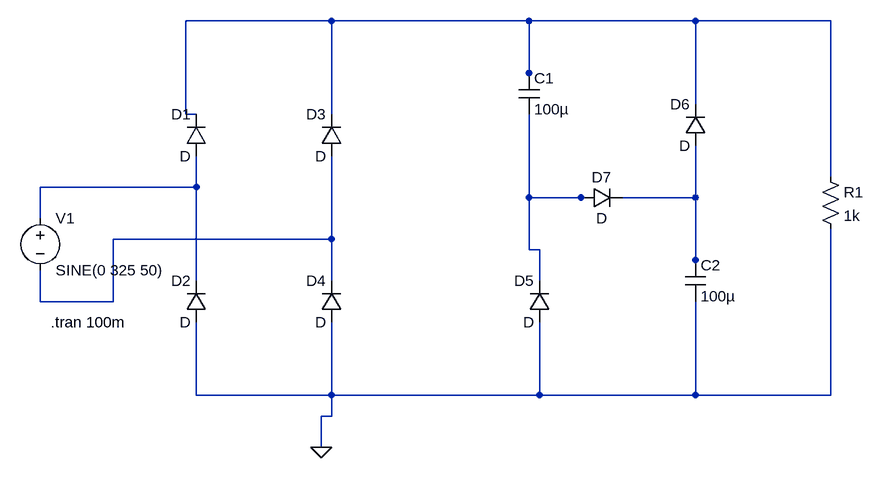
[diagram p0: schematic passive pfc correction.asc]
passive pfc correction.asc, the LTspice schematic file:
Version 4
SHEET 1 1224 680
WIRE 400 -192 176 -192
WIRE 704 -192 400 -192
WIRE 960 -192 704 -192
WIRE 1168 -192 960 -192
WIRE 704 -112 704 -192
WIRE 704 -96 704 -112
WIRE 960 -64 960 -192
WIRE 176 -48 176 -192
WIRE 192 -48 176 -48
WIRE 400 -48 400 -192
WIRE 1168 48 1168 -192
WIRE 192 64 192 16
WIRE 192 64 -48 64
WIRE 704 80 704 -48
WIRE 784 80 704 80
WIRE 800 80 784 80
WIRE 960 80 960 0
WIRE 960 80 848 80
WIRE -48 112 -48 64
WIRE 400 144 400 16
WIRE 400 144 64 144
WIRE 704 160 704 80
WIRE 720 160 704 160
WIRE 960 176 960 80
WIRE 960 192 960 176
WIRE 192 208 192 64
WIRE 400 208 400 144
WIRE 720 208 720 160
WIRE -48 240 -48 192
WIRE 64 240 64 144
WIRE 64 240 -48 240
WIRE 192 384 192 272
WIRE 400 384 400 272
WIRE 400 384 192 384
WIRE 720 384 720 272
WIRE 720 384 400 384
WIRE 960 384 960 240
WIRE 960 384 720 384
WIRE 1168 384 1168 128
WIRE 1168 384 960 384
WIRE 400 416 400 384
WIRE 400 416 384 416
WIRE 384 464 384 416
FLAG 384 464 0
SYMBOL voltage -48 96 R0
WINDOW 123 0 0 Left 0
WINDOW 39 0 0 Left 0
SYMATTR InstName V1
SYMATTR Value SINE(0 325 50)
SYMBOL diode 208 16 R180
WINDOW 0 24 64 Left 2
WINDOW 3 24 0 Left 2
SYMATTR InstName D1
SYMBOL diode 208 272 R180
WINDOW 0 24 64 Left 2
WINDOW 3 24 0 Left 2
SYMATTR InstName D2
SYMBOL diode 416 16 R180
WINDOW 0 24 64 Left 2
WINDOW 3 24 0 Left 2
SYMATTR InstName D3
SYMBOL diode 416 272 R180
WINDOW 0 24 64 Left 2
WINDOW 3 24 0 Left 2
SYMATTR InstName D4
SYMBOL diode 736 272 R180
WINDOW 0 24 64 Left 2
WINDOW 3 24 0 Left 2
SYMATTR InstName D5
SYMBOL diode 976 0 R180
WINDOW 0 24 64 Left 2
WINDOW 3 24 0 Left 2
SYMATTR InstName D6
SYMBOL cap 688 -112 R0
SYMATTR InstName C1
SYMATTR Value 100µ
SYMBOL diode 784 96 R270
WINDOW 0 32 32 VTop 2
WINDOW 3 0 32 VBottom 2
SYMATTR InstName D7
SYMBOL res 1152 32 R0
SYMATTR InstName R1
SYMATTR Value 1k
SYMBOL cap 944 176 R0
SYMATTR InstName C2
SYMATTR Value 100µ
TEXT -32 272 Left 2 !.tran 100m

The netlist it stands for:
* passive pfc correction.asc
V1 N002 N005 SINE(0 325 50)
D1 N002 N001 D
D2 0 N002 D
D3 N005 N001 D
D4 0 N005 D
D5 0 N003 D
D6 N004 N001 D
C1 N001 N003 100µ
D7 N003 N004 D
R1 N001 0 1k
C2 N004 0 100µ
.model D D
.lib standard.dio
.tran 100m
.backanno
.end